# Altium project ESP32_INDUSTRIAL_IO.PrjPcb (part 2 of 2)

## Sheet EtherCAT.SchDoc
size B
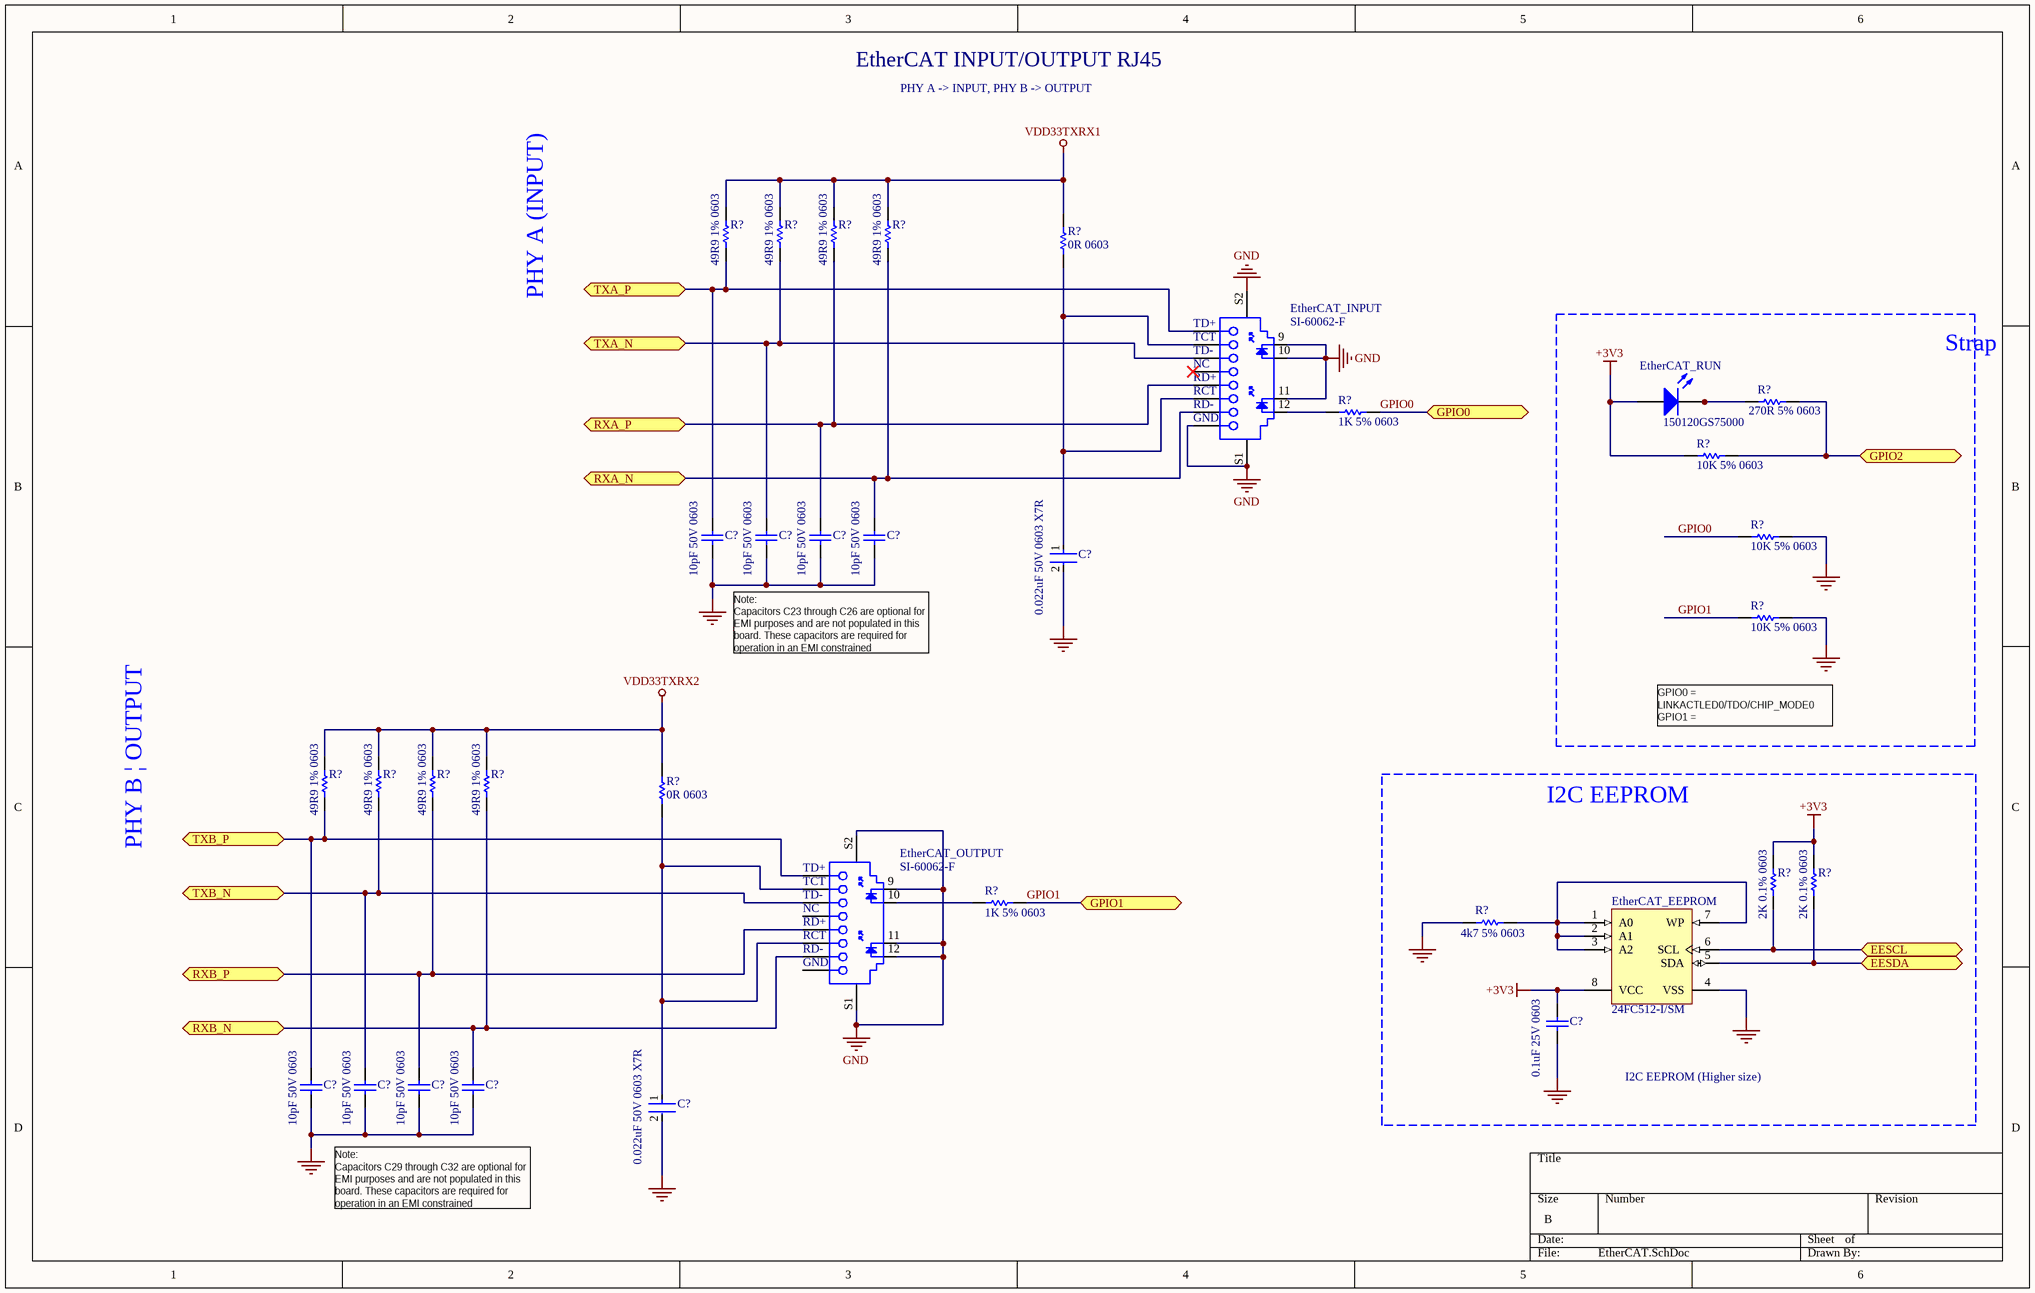
[diagram p5: EtherCAT.SchDoc]

### Parts
(Parts that share a designator on the sheet are numbered #1, #2 ... from top to bottom, then left to right.)
C?#23  10pF 50V 0603  [CAPC1608X90X35LL10T15]
C?#24  10pF 50V 0603  [CAPC1608X90X35LL10T15]
C?#25  10pF 50V 0603  [CAPC1608X90X35LL10T15]
C?#26  10pF 50V 0603  [CAPC1608X90X35LL10T15]
C?#27  0.022uF 50V 0603 X7R  [FP-C0603C-CF-MFG]
C?#28  0.1uF 25V 0603  [CAPC1608X90X35LL10T15]
C?#29  10pF 50V 0603  [CAPC1608X90X35LL10T15]
C?#30  10pF 50V 0603  [CAPC1608X90X35LL10T15]
C?#31  10pF 50V 0603  [CAPC1608X90X35LL10T15]
C?#32  10pF 50V 0603  [CAPC1608X90X35LL10T15]
C?#33  0.022uF 50V 0603 X7R  [FP-C0603C-CF-MFG]
EtherCAT_EEPROM  24FC512-I/SM  [SOIJ-SM8_M]
EtherCAT_INPUT  SI-60062-F  [BELF-SI-60062-F_V]
EtherCAT_OUTPUT  SI-60062-F  [BELF-SI-60062-F_V]
EtherCAT_RUN  150120GS75000  [1206_A]
R?#5  49R9 1% 0603  [RESC1608X55X25NL10T15]
R?#6  49R9 1% 0603  [RESC1608X55X25NL10T15]
R?#7  49R9 1% 0603  [RESC1608X55X25NL10T15]
R?#8  49R9 1% 0603  [RESC1608X55X25NL10T15]
R?#9  0R 0603  [RESC1608X55X25ML10T15]
R?#10  270R 5% 0603  [RESC1608X55X25LL10T15]
R?#11  1K 5% 0603  [RESC1608X55X25NL10T15]
R?#12  10K 5% 0603  [RESC1608X55X25ML10T15]
R?#13  10K 5% 0603  [RESC1608X55X25ML10T15]
R?#14  10K 5% 0603  [RESC1608X55X25ML10T15]
R?#15  49R9 1% 0603  [RESC1608X55X25NL10T15]
R?#16  49R9 1% 0603  [RESC1608X55X25NL10T15]
R?#17  49R9 1% 0603  [RESC1608X55X25NL10T15]
R?#18  49R9 1% 0603  [RESC1608X55X25NL10T15]
R?#19  0R 0603  [RESC1608X55X25ML10T15]
R?#20  2K 0.1% 0603  [RESC1608X55X25ML10T15]
R?#21  2K 0.1% 0603  [RESC1608X55X25ML10T15]
R?#22  1K 5% 0603  [RESC1608X55X25NL10T15]
R?#23  4k7 5% 0603  [RESC1608X55X25ML10T15]

### Blocks framed on the sheet
Strap: EtherCAT_RUN R?#10 R?#12-R?#14
I2C EEPROM: C?#28 EtherCAT_EEPROM R?#20 R?#21 R?#23

### Ports
EESCL (bidir), EESDA (bidir), GPIO0 (bidir), GPIO1 (bidir), GPIO2 (bidir), RXA_N (bidir), RXA_P (bidir), RXB_N (bidir), RXB_P (bidir), TXA_N (bidir), TXA_P (bidir), TXB_N (bidir), TXB_P (bidir)

### Nets
+3V3: C?#28.2 EtherCAT_EEPROM.8(VCC) EtherCAT_RUN.2(A) R?#12.2 R?#20.2 R?#21.2
GND: C?#23.1 C?#24.1 C?#25.1 C?#26.1 C?#27.2 C?#28.1 C?#29.1 C?#30.1 C?#31.1 C?#32.1 C?#33.2 EtherCAT_EEPROM.4(VSS) EtherCAT_INPUT.8(GND) EtherCAT_INPUT.9 EtherCAT_INPUT.10 EtherCAT_INPUT.11 EtherCAT_INPUT.S1 EtherCAT_INPUT.S2 EtherCAT_OUTPUT.9 EtherCAT_OUTPUT.11 EtherCAT_OUTPUT.12 EtherCAT_OUTPUT.S1 EtherCAT_OUTPUT.S2 R?#13.1 R?#14.1 R?#23.1
VDD33TXRX1: R?#5.2 R?#6.2 R?#7.2 R?#8.2 R?#9.2
VDD33TXRX2: R?#15.2 R?#16.2 R?#17.2 R?#18.2 R?#19.2
GPIO0: R?#11.2 R?#13.2 ; port GPIO0
GPIO1: R?#14.2 R?#22.2 ; port GPIO1
NetC?#23_2: C?#23.2 EtherCAT_INPUT.1(TD+) R?#5.1 ; port TXA_P
NetC?#24_2: C?#24.2 EtherCAT_INPUT.3(TD-) R?#6.1 ; port TXA_N
NetC?#25_2: C?#25.2 EtherCAT_INPUT.5(RD+) R?#7.1 ; port RXA_P
NetC?#26_2: C?#26.2 EtherCAT_INPUT.7(RD-) R?#8.1 ; port RXA_N
NetC?#27_1: C?#27.1 EtherCAT_INPUT.2(TCT) EtherCAT_INPUT.6(RCT) R?#9.1
NetC?#29_2: C?#29.2 EtherCAT_OUTPUT.1(TD+) R?#15.1 ; port TXB_P
NetC?#30_2: C?#30.2 EtherCAT_OUTPUT.3(TD-) R?#16.1 ; port TXB_N
NetC?#31_2: C?#31.2 EtherCAT_OUTPUT.5(RD+) R?#17.1 ; port RXB_P
NetC?#32_2: C?#32.2 EtherCAT_OUTPUT.7(RD-) R?#18.1 ; port RXB_N
NetC?#33_1: C?#33.1 EtherCAT_OUTPUT.2(TCT) EtherCAT_OUTPUT.6(RCT) R?#19.1
NetEtherCAT_EEPROM_1: EtherCAT_EEPROM.1(A0) EtherCAT_EEPROM.2(A1) EtherCAT_EEPROM.3(A2) EtherCAT_EEPROM.7(WP) R?#23.2
NetEtherCAT_EEPROM_5: EtherCAT_EEPROM.5(SDA) R?#21.1 ; port EESDA
NetEtherCAT_EEPROM_6: EtherCAT_EEPROM.6(SCL) R?#20.1 ; port EESCL
NetEtherCAT_INPUT_12: EtherCAT_INPUT.12 R?#11.1
NetEtherCAT_OUTPUT_10: EtherCAT_OUTPUT.10 R?#22.1
NetEtherCAT_RUN_1: EtherCAT_RUN.1(K) R?#10.1
NetLAN9252_45: R?#10.2 R?#12.1 ; port GPIO2

Not connected (* = marked no-connect by the designer): EtherCAT_INPUT 4(NC)*; EtherCAT_OUTPUT 4(NC) 8(GND)

### Notes on the sheet
- EtherCAT INPUT/OUTPUT RJ45
- PHY A -> INPUT, PHY B -> OUTPUT
- PHY A (INPUT)
- (near C?#24) Note:
  Capacitors C23 through C26 are optional for EMI purposes and are not populated in this  board. These capacitors are required for operation in an EMI constrained environment.
- GPIO0 = LINKACTLED0/TDO/CHIP_MODE0
  GPIO1 = LINKACTLED1/TDI/CHIP_MODE1
  GPIO2 = RUNLED/E2PSIZE
- PHY B | OUTPUT
- I2C EEPROM (Higher size)
- (near C?#30) Note:
  Capacitors C29 through C32 are optional for EMI purposes and are not populated in this  board. These capacitors are required for operation in an EMI constrained environment.

### Library data of the parts
C?#23-C?#26 C?#29-C?#32 = CMP-2006-02592-1: Part Number: GRM1885C1H100JA01D; Manufacturer: Murata
C?#27 C?#33 = CMP-2006-03879-3: Ceramic Capacitor 0.022Uf 50V, X7R, 10%, 0603, Full Reel; Manufacturer Part Number: C0603C223K5RACTU; Manufacturer: KEMET; Automotive Grade: Grade 1; Capacitance: 22,000 pF; Value: 22,000 pF; Tolerance: 0.1; Temperature Coefficient: 30ppm/°C; Material: Ceramic; Mouser Description: Capacitor; Ceramic; Cap; .022uF; Tol+10%; SMT; Vol-Rtg 50V; X7R; TR; Voltage Rating: 50 V; Category: Cap; Device Class L2: Capacitors; RoHS: TRUE; Package: C0603C-CF; Device Class L1: Passive Components; Temperature Range Low: -55°C; Octopart: https://octopart.com/c0603c223k5ractu-kemet-97352; Temperature: -55°C to +125°C; Temperature Range High: +125°C; Automotive: Yes; Lead Free: Yes; ComponentLink2URL: https://api.kemet.com/component-edge/download/datasheet/C0603C100J5GACAUTO.pdf; Temperature Characteristic: X7R; Height: 0.87mm; Device Class L3: Ceramic Capacitors; Digikey Description: Ceramic Capacitor 0.022Uf 50V, X7R, 10%, 0603, Full Reel; ComponentLink2Description: Datasheet
C?#28 = CMP-2006-02868-1: Part Number: GRM188R71E104KA01D; Manufacturer: Murata
EtherCAT_EEPROM = CMP-0159-00532-1: 512Kbit, 1MHz, 2.5V, I2C Serial EEPROM, 8-Pin SOIC 208mil, Industrial Temperature; PackageDescription: 8-Lead Plastic Small Outline (SM) - Medium, 5.28 mm Body [SOIJ]; PackageReference: SOIJ-SM8; PackageVersion: revBB, Aug-2009; DatasheetVersion: revJ, Jul-2008
EtherCAT_INPUT EtherCAT_OUTPUT = CMP-2000-07059-1: 1 Port RJ45 Magjack Connector with Yellow and Green LED, 10/100 Base-T, 12-Pin THD, RoHS, Tray; Manufacturer: Bel Fuse; Number of Ways: 8P4C; Gender: Female; Shield Type: STP; Connector Type: RJ45; Contact Plating: Gold; Mounting Type: ThroughHole; Datasheet Version: Rev. B0, 09/2008; Package Reference: SI-60062-F; Manufacturer URL: http://belfuse.com/; Package Description: 12-Pin Through Hole Device, Body 21.59 x 16.13 mm; Series: MagJack; Contact Material: CopperAlloy; Datasheet URL: http://belfuse.com/pdfs/SI-60062-F.pdf; Width: 17.98mm; Length: 15.21mm; Mounting Technology: ThroughHole; Depth: 21.59mm; Orientation: Straight
EtherCAT_RUN = CMP-1426-00014-1: SMD mono-color Chip LED, WL-SMCW, Green; Manufacturer: Wuerth Elektronik; PackageReference: 1206_A; PartNumber: 150120GS75000; ComponentLink1Description: Manufacturer URL; ComponentLink2URL: http://katalog.we-online.com/led/datasheet/150120GS75000.pdf; ComponentLink2Description: Datasheet; Color: Green; ComponentLink1URL: http://www.we-online.com
R?#5-R?#8 R?#15-R?#18 = CMP-1659-00036-1: General Purpose Chip Resistor, 49.9 Ohm, +/- 1%, -55 to 155 degC, 0603 (1608 Metric), RoHS, Tape and Reel; Max Supply Voltage: 3.63 V; Case\Package: LQFP; Interface: SPI; Min Supply Voltage: 2.97 V; PackageReference: 0603; Packaging: Tray; ComponentLink2Description: Datasheet; ComponentLink1Description: Manufacturer URL; ComponentLink2URL: https://datasheet.ciiva.com/11808/0900766b80f96399-11808223.pdf; RoHSCompliant: true; Max Operating Temperature: 85 degC; ComponentLink1URL: http://www.yageo.com/; PackageDescription: 2-Pin Surface Mount Device, Body 1.6 x 0.8 mm; DatasheetVersion: Rev. 4, 04/2009; Min Operating Temperature: -40 degC; Package Quantity: 250; Pins: 48
R?#9 R?#19 = CMP-2100-03667-1: Chip Resistor, 0 Ohm, +/- 5%, 0.1 W, -55 to 155 degC, 0603 (1608 Metric), RoHS, Tape and Reel; Manufacturer: Yageo; Temperature Coefficient: 200ppm/degreesC; Voltage Rating: 50V; Power Rating: 100mW; Resistance: 0mOhm; Width: 0.8mm; Max Operating Temperature: 155degC; Tolerance: 5%; Package Reference: 0603; Height: 0.45mm; Depth: 0.8mm; Package Description: 2-Pin Surface Mount Device, Body 1.6 x 0.8 mm; Termination: SMD/SMT; Package Quantity: 5000; Case/Package: 0603; Case Code (Imperial): 0603; Radiation Hardening: No; Number of Pins: 2; Length: 1.6mm; Lead Free: LeadFree; Voltage Rating (DC): 50V; Military Standard: Not; Datasheet URL: http://www.yageo.com/NewPortal/yageodocoutput?fileName=/pdf/R-Chip/PYu-RC_Group_51_RoHS_L_5.pdf; Manufacturer URL: http://www.yageo.com/; Packaging: TapeandReel; Case Code (Metric): 1608; Min Operating Temperature: -55degC; Composition: ThickFilm; RoHSCompliant: true; Contact Plating: Tin; Datasheet Version: Rev. 5, 10/2016; REACH SVHC: NoSVHC
R?#10 = CMP-2000-06956-1: Chip Resistor, 270 Ohm, +/- 5%, 0.1 W, -55 to 155 degC, 0603 (1608 Metric), RoHS, Tape and Reel; Manufacturer: Yageo; Resistor Case Style: 0603[1608Metric]; Resistance: 270ohm; Resistor Element Type: ThickFilm; Voltage Rating: 50V; Temperature Coefficient: ±100ppm/°C; SVHC: ToBeAdvised; Product Range: RCSeries; Power Rating: 100mW; MSL: MSL1-Unlimited; Datasheet URL: http://www.yageo.com/documents/recent/PYu-RC_Group_51_RoHS_L_7.pdf; Packaging: CutTape; Manufacturer URL: http://www.yageo.com/; Automotive Qualification Standard: -; Resistance Tolerance: ±5%; Package Reference: 0603; Package Description: 2-Pin Surface Mount Device, Body 1.6 x 0.8 mm; Mounting Technology: SurfaceMount; Datasheet Version: Rev. 7, 05/2017
R?#11 R?#22 = CMP-1659-00009-4: Chip Resistor, 1 KOhm, +/-1%, 0.1 W, -55 to 155 degC, 0603 (1608 Metric), RoHS, Tape and Reel; Manufacturer: Yageo; Voltage Rating: 50 V; ComponentLink2URL: http://www.yageo.com/documents/recent/PYu-RC_Group_51_RoHS_L_04.pdf; Max Operating Temperature: 155 degC; PackageDescription: 2-Pin Surface Mount Device, Body 1.6 x 0.8 mm; Packaging: Tape and Reel; ComponentLink3Description: Package Specification; REACH SVHC: No SVHC; Mount: Surface Mount; ComponentLink2Description: Datasheet; Length: 1.6 mm; PackageReference: 0603; Height: 0.45 mm; DatasheetVersion: Rev. 4, 02/2016; Min Operating Temperature: -55 degC; ComponentLink1Description: Manufacturer URL; Package Quantity: 200; RoHSCompliant: true; ComponentLink3URL: http://www.farnell.com/datasheets/443971.pdf; Pins: 2; Mounting Technology: Surface Mount; ComponentLink1URL: http://www.yageo.com/
R?#12-R?#14 = CMP-2100-03664-1: Chip Resistor, 10 KOhm, +/- 1%, 01 W, -55 to 155 degC, 0603 (1608 Metric), RoHS, Tape and Reel; Manufacturer: Yageo; Temperature Coefficient: 100ppm/degreesC; Resistance: 10KOhm; Voltage Rating: 75V; Power Rating: 100mW; Voltage Rating (DC): 50V; Composition: ThickFilm; RoHSCompliant: true; Height: 0.45mm; Lead Free: LeadFree; Case Code (Metric): 1608; Case/Package: 0603; Datasheet Version: Rev. 5, 10/2016; Package Reference: 0603; Depth: 0.8mm; Package Description: 2-Pin Surface Mount Device, Body 1.6 x 0.8 mm; Case Code (Imperial): 0603; Packaging: TapeandReel; Termination: SMD/SMT; Lead Pitch: 0.3mm; Width: 0.8mm; Number of Pins: 2; Length: 1.6mm; REACH SVHC: NoSVHC; Military Standard: Not; Max Operating Temperature: 155degC; Min Operating Temperature: -55degC; Manufacturer URL: http://www.yageo.com/; Datasheet URL: http://www.yageo.com/NewPortal/yageodocoutput?fileName=/pdf/R-Chip/PYu-RC_Group_51_RoHS_L_5.pdf; Weight: 7.1E-05oz; Tolerance: 1%
R?#20 R?#21 = CMP-2000-04430-1: Part Number: RT0603BRD072KL; Manufacturer: Yageo
R?#23 = CMP-2000-05024-1: Chip Resistor, 4.7 KOhm, +/- 5%, 100 mW, -55 to 155 degC, 0603 (1608 Metric), RoHS, Tape and Reel; Manufacturer: Yageo; Resistance: 4.7kOhms; Temperature Coefficient: 100PPM/C; Power Rating: 100mW; Voltage Rating: 50V; Operating Temperature Range: -55Cto+155C; Case Code - mm: 1608; Tolerance: 5%; Product: ThickFilmResistorsGeneralPurpose; Case Code - in: 0603; Datasheet URL: http://www.yageo.com/documents/recent/PYu-RC_Group_51_RoHS_L_04.pdf; Package Reference: 603; Datasheet Version: Rev. 4, 02/2016; Package Description: 2-Pin Surface Mount Device, Body 1.6 x 0.8 mm; Manufacturer URL: http://www.yageo.com/; Series: RC; Packaging: Reel; Termination Style: SMD/SMT

## Sheet MCP23017-1.SchDoc
size B
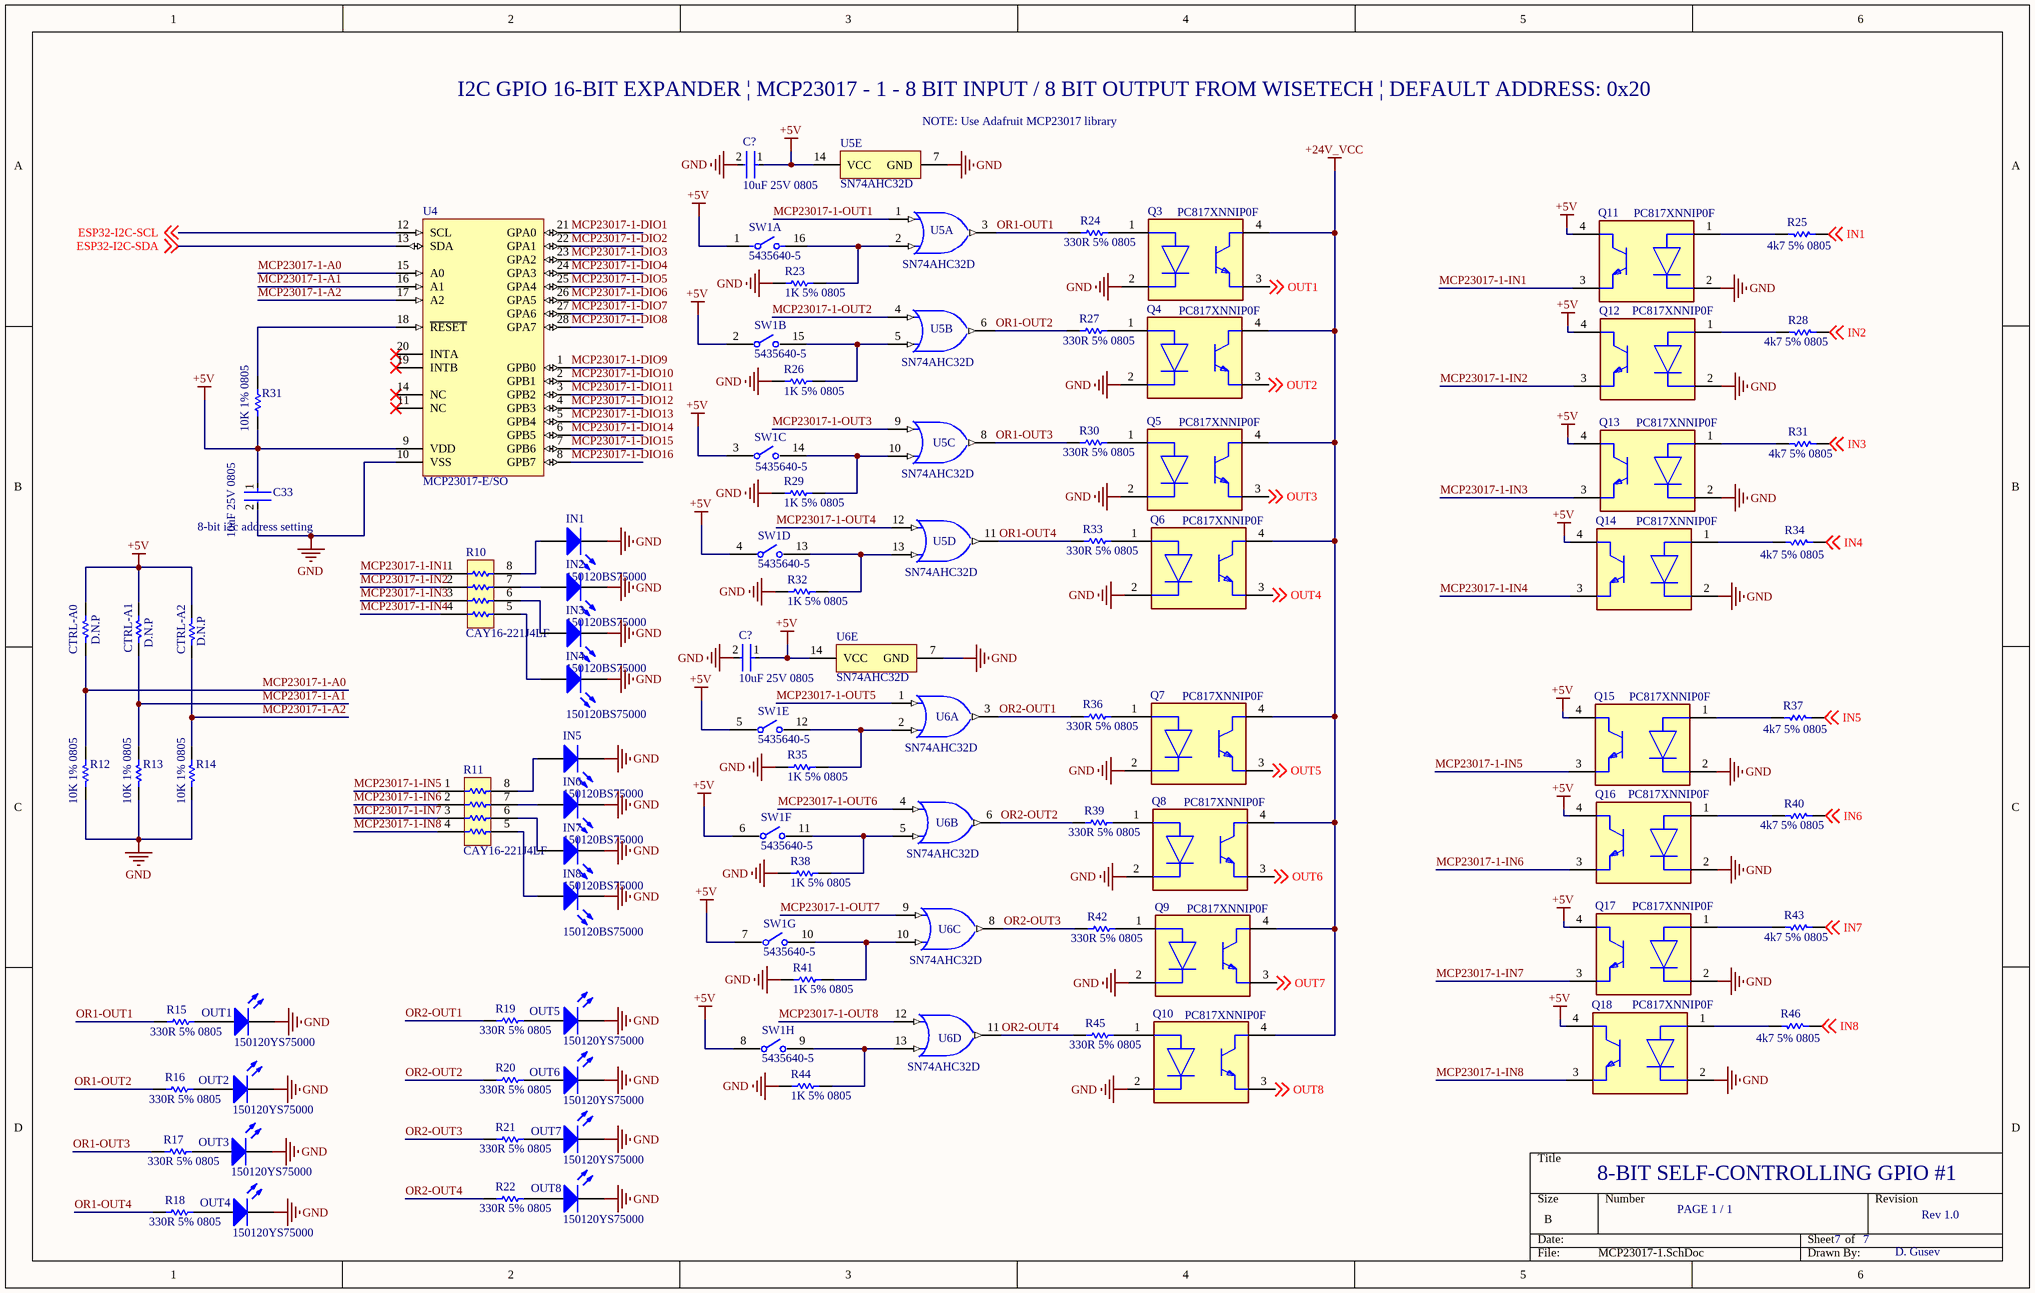
[diagram p6: MCP23017-1.SchDoc]

### Parts
(Parts that share a designator on the sheet are numbered #1, #2 ... from top to bottom, then left to right.)
C33  10uF 25V 0805  [FP-GRM21B-0_15-IPC_B]
C?#34  10uF 25V 0805  [FP-GRM21B-0_15-IPC_B]
C?#35  10uF 25V 0805  [FP-GRM21B-0_15-IPC_B]
CTRL-A0  D.N.P  [RESC2013X60X35LL10T20]
CTRL-A1  D.N.P  [RESC2013X60X35LL10T20]
CTRL-A2  D.N.P  [RESC2013X60X35LL10T20]
IN1  150120BS75000  [1206_A]
IN2  150120BS75000  [1206_A]
IN3  150120BS75000  [1206_A]
IN4  150120BS75000  [1206_A]
IN5  150120BS75000  [1206_A]
IN6  150120BS75000  [1206_A]
IN7  150120BS75000  [1206_A]
IN8  150120BS75000  [1206_A]
OUT1  150120YS75000  [1206_A]
OUT2  150120YS75000  [1206_A]
OUT3  150120YS75000  [1206_A]
OUT4  150120YS75000  [1206_A]
OUT5  150120YS75000  [1206_A]
OUT6  150120YS75000  [1206_A]
OUT7  150120YS75000  [1206_A]
OUT8  150120YS75000  [1206_A]
Q3  PC817XNNIP0F  [FP-PC817XNNIP0F-MFG]
Q4  PC817XNNIP0F  [FP-PC817XNNIP0F-MFG]
Q5  PC817XNNIP0F  [FP-PC817XNNIP0F-MFG]
Q6  PC817XNNIP0F  [FP-PC817XNNIP0F-MFG]
Q7  PC817XNNIP0F  [FP-PC817XNNIP0F-MFG]
Q8  PC817XNNIP0F  [FP-PC817XNNIP0F-MFG]
Q9  PC817XNNIP0F  [FP-PC817XNNIP0F-MFG]
Q10  PC817XNNIP0F  [FP-PC817XNNIP0F-MFG]
Q11  PC817XNNIP0F  [FP-PC817XNNIP0F-MFG]
Q12  PC817XNNIP0F  [FP-PC817XNNIP0F-MFG]
Q13  PC817XNNIP0F  [FP-PC817XNNIP0F-MFG]
Q14  PC817XNNIP0F  [FP-PC817XNNIP0F-MFG]
Q15  PC817XNNIP0F  [FP-PC817XNNIP0F-MFG]
Q16  PC817XNNIP0F  [FP-PC817XNNIP0F-MFG]
Q17  PC817XNNIP0F  [FP-PC817XNNIP0F-MFG]
Q18  PC817XNNIP0F  [FP-PC817XNNIP0F-MFG]
R10  CAY16-221J4LF  [BOUR-CAY16-J4_V]
R11  CAY16-221J4LF  [BOUR-CAY16-J4_V]
R12  10K 1% 0805  [RESC2013X60X35ML10T20]
R13  10K 1% 0805  [RESC2013X60X35ML10T20]
R14  10K 1% 0805  [RESC2013X60X35ML10T20]
R15  330R 5% 0805  [RESC2013X60X35LL10T20]
R16  330R 5% 0805  [RESC2013X60X35LL10T20]
R17  330R 5% 0805  [RESC2013X60X35LL10T20]
R18  330R 5% 0805  [RESC2013X60X35LL10T20]
R19  330R 5% 0805  [RESC2013X60X35LL10T20]
R20  330R 5% 0805  [RESC2013X60X35LL10T20]
R21  330R 5% 0805  [RESC2013X60X35LL10T20]
R22  330R 5% 0805  [RESC2013X60X35LL10T20]
R23  1K 5% 0805  [RESC2013X60X35ML10T20]
R24  330R 5% 0805  [RESC2013X60X35LL10T20]
R25  4k7 5% 0805  [YAGO-RC0805_M]
R26  1K 5% 0805  [RESC2013X60X35ML10T20]
R27  330R 5% 0805  [RESC2013X60X35LL10T20]
R28  4k7 5% 0805  [YAGO-RC0805_M]
R29  1K 5% 0805  [RESC2013X60X35ML10T20]
R30  330R 5% 0805  [RESC2013X60X35LL10T20]
R31#1  10K 1% 0805  [RESC2013X60X35ML10T20]
R31#2  4k7 5% 0805  [YAGO-RC0805_M]
R32  1K 5% 0805  [RESC2013X60X35ML10T20]
R33  330R 5% 0805  [RESC2013X60X35LL10T20]
R34  4k7 5% 0805  [YAGO-RC0805_M]
R35  1K 5% 0805  [RESC2013X60X35ML10T20]
R36  330R 5% 0805  [RESC2013X60X35LL10T20]
R37  4k7 5% 0805  [YAGO-RC0805_M]
R38  1K 5% 0805  [RESC2013X60X35ML10T20]
R39  330R 5% 0805  [RESC2013X60X35LL10T20]
R40  4k7 5% 0805  [YAGO-RC0805_M]
R41  1K 5% 0805  [RESC2013X60X35ML10T20]
R42  330R 5% 0805  [RESC2013X60X35LL10T20]
R43  4k7 5% 0805  [YAGO-RC0805_M]
R44  1K 5% 0805  [RESC2013X60X35ML10T20]
R45  330R 5% 0805  [RESC2013X60X35LL10T20]
R46  4k7 5% 0805  [YAGO-RC0805_M]
SW1  5435640-5  [FP-5435640-5-MFG]  (parts A,B,C,D,E,F,G,H of 8)
U4  MCP23017-E/SO  [SOIC-SO28_N]
U5  SN74AHC32D  [D0014A_M]  (parts A,B,C,D,E of 5)
U6  SN74AHC32D  [D0014A_M]  (parts A,B,C,D,E of 5)

### Nets
+5V: C33.1 C?#34.1 C?#35.1 CTRL-A0.2 CTRL-A1.2 CTRL-A2.2 Q11.4(C) Q12.4(C) Q13.4(C) Q14.4(C) Q15.4(C) Q16.4(C) Q17.4(C) Q18.4(C) R31#1.1 SW1.1 SW1.2 SW1.3 SW1.4 SW1.5 SW1.6 SW1.7 SW1.8 U4.9(VDD) U5.14(VCC) U6.14(VCC)
+24V_VCC: Q3.4(C) Q4.4(C) Q5.4(C) Q6.4(C) Q7.4(C) Q8.4(C) Q9.4(C) Q10.4(C)
GND: C33.2 C?#34.2 C?#35.2 IN1.1(K) IN2.1(K) IN3.1(K) IN4.1(K) IN5.1(K) IN6.1(K) IN7.1(K) IN8.1(K) OUT1.1(K) OUT2.1(K) OUT3.1(K) OUT4.1(K) OUT5.1(K) OUT6.1(K) OUT7.1(K) OUT8.1(K) Q3.2(C) Q4.2(C) Q5.2(C) Q6.2(C) Q7.2(C) Q8.2(C) Q9.2(C) Q10.2(C) Q11.2(C) Q12.2(C) Q13.2(C) Q14.2(C) Q15.2(C) Q16.2(C) Q17.2(C) Q18.2(C) R12.2 R13.2 R14.2 R23.1 R26.1 R29.1 R32.1 R35.1 R38.1 R41.1 R44.1 U4.10(VSS) U5.7(GND) U6.7(GND)
ESP32-I2C-SCL: U4.12(SCL) ; off-sheet ESP32-I2C-SCL
ESP32-I2C-SDA: U4.13(SDA) ; off-sheet ESP32-I2C-SDA
IN1: R25.1 ; off-sheet IN1
IN2: R28.1 ; off-sheet IN2
IN3: R31#2.1 ; off-sheet IN3
IN4: R34.1 ; off-sheet IN4
IN5: R37.1 ; off-sheet IN5
IN6: R40.1 ; off-sheet IN6
IN7: R43.1 ; off-sheet IN7
IN8: R46.1 ; off-sheet IN8
MCP23017-1-A0: CTRL-A0.1 R12.1 U4.15(A0)
MCP23017-1-A1: CTRL-A1.1 R13.1 U4.16(A1)
MCP23017-1-A2: CTRL-A2.1 R14.1 U4.17(A2)
MCP23017-1-DIO1: U4.21(GPA0)
MCP23017-1-DIO2: U4.22(GPA1)
MCP23017-1-DIO3: U4.23(GPA2)
MCP23017-1-DIO4: U4.24(GPA3)
MCP23017-1-DIO5: U4.25(GPA4)
MCP23017-1-DIO6: U4.26(GPA5)
MCP23017-1-DIO7: U4.27(GPA6)
MCP23017-1-DIO8: U4.28(GPA7)
MCP23017-1-DIO9: U4.1(GPB0)
MCP23017-1-DIO10: U4.2(GPB1)
MCP23017-1-DIO11: U4.3(GPB2)
MCP23017-1-DIO12: U4.4(GPB3)
MCP23017-1-DIO13: U4.5(GPB4)
MCP23017-1-DIO14: U4.6(GPB5)
MCP23017-1-DIO15: U4.7(GPB6)
MCP23017-1-DIO16: U4.8(GPB7)
MCP23017-1-IN1: Q11.3(E) R10.1
MCP23017-1-IN2: Q12.3(E) R10.2
MCP23017-1-IN3: Q13.3(E) R10.3
MCP23017-1-IN4: Q14.3(E) R10.4
MCP23017-1-IN5: Q15.3(E) R11.1
MCP23017-1-IN6: Q16.3(E) R11.2
MCP23017-1-IN7: Q17.3(E) R11.3
MCP23017-1-IN8: Q18.3(E) R11.4
MCP23017-1-OUT1: U5.1(1A)
MCP23017-1-OUT2: U5.4(2A)
MCP23017-1-OUT3: U5.9(3A)
MCP23017-1-OUT4: U5.12(4A)
MCP23017-1-OUT5: U6.1(1A)
MCP23017-1-OUT6: U6.4(2A)
MCP23017-1-OUT7: U6.9(3A)
MCP23017-1-OUT8: U6.12(4A)
OR1-OUT1: R15.1 R24.1 U5.3(1Y)
OR1-OUT2: R16.1 R27.1 U5.6(2Y)
OR1-OUT3: R17.1 R30.1 U5.8(3Y)
OR1-OUT4: R18.1 R33.1 U5.11(4Y)
OR2-OUT1: R19.1 R36.1 U6.3(1Y)
OR2-OUT2: R20.1 R39.1 U6.6(2Y)
OR2-OUT3: R21.1 R42.1 U6.8(3Y)
OR2-OUT4: R22.1 R45.1 U6.11(4Y)
OUT1: Q3.3(E) ; off-sheet OUT1
OUT2: Q4.3(E) ; off-sheet OUT2
OUT3: Q5.3(E) ; off-sheet OUT3
OUT4: Q6.3(E) ; off-sheet OUT4
OUT5: Q7.3(E) ; off-sheet OUT5
OUT6: Q8.3(E) ; off-sheet OUT6
OUT7: Q9.3(E) ; off-sheet OUT7
OUT8: Q10.3(E) ; off-sheet OUT8
NetIN1_2: IN1.2(A) R10.8
NetIN2_2: IN2.2(A) R10.7
NetIN3_2: IN3.2(A) R10.6
NetIN4_2: IN4.2(A) R10.5
NetIN5_2: IN5.2(A) R11.8
NetIN6_2: IN6.2(A) R11.7
NetIN7_2: IN7.2(A) R11.6
NetIN8_2: IN8.2(A) R11.5
NetOUT1_2: OUT1.2(A) R15.2
NetOUT2_2: OUT2.2(A) R16.2
NetOUT3_2: OUT3.2(A) R17.2
NetOUT4_2: OUT4.2(A) R18.2
NetOUT5_2: OUT5.2(A) R19.2
NetOUT6_2: OUT6.2(A) R20.2
NetOUT7_2: OUT7.2(A) R21.2
NetOUT8_2: OUT8.2(A) R22.2
NetQ3_1: Q3.1(A) R24.2
NetQ4_1: Q4.1(A) R27.2
NetQ5_1: Q5.1(A) R30.2
NetQ6_1: Q6.1(A) R33.2
NetQ7_1: Q7.1(A) R36.2
NetQ8_1: Q8.1(A) R39.2
NetQ9_1: Q9.1(A) R42.2
NetQ10_1: Q10.1(A) R45.2
NetQ11_1: Q11.1(A) R25.2
NetQ12_1: Q12.1(A) R28.2
NetQ13_1: Q13.1(A) R31#2.2
NetQ14_1: Q14.1(A) R34.2
NetQ15_1: Q15.1(A) R37.2
NetQ16_1: Q16.1(A) R40.2
NetQ17_1: Q17.1(A) R43.2
NetQ18_1: Q18.1(A) R46.2
NetR23_2: R23.2 SW1.16 U5.2(1B)
NetR26_2: R26.2 SW1.15 U5.5(2B)
NetR29_2: R29.2 SW1.14 U5.10(3B)
NetR31#1_2: R31#1.2 U4.18(~{RESET})
NetR32_2: R32.2 SW1.13 U5.13(4B)
NetR35_2: R35.2 SW1.12 U6.2(1B)
NetR38_2: R38.2 SW1.11 U6.5(2B)
NetR41_2: R41.2 SW1.10 U6.10(3B)
NetR44_2: R44.2 SW1.9 U6.13(4B)

Not connected (* = marked no-connect by the designer): U4 11(NC)* 14(NC)* 19(INTB)* 20(INTA)*

### Notes on the sheet
- I2C GPIO 16-BIT EXPANDER | MCP23017 - 1 - 8 BIT INPUT / 8 BIT OUTPUT FROM WISETECH | DEFAULT ADDRESS: 0x20
- (near U5) NOTE: Use Adafruit MCP23017 library
- 8-bit i2c address setting
- 8-BIT SELF-CONTROLLING GPIO #1
- PAGE 1 / 1
- 7
- Rev 1.0
- D. Gusev

### Library data of the parts
C33 C?#34 C?#35 = CMP-2007-03541-2: Chip Multilayer Ceramic Capacitors for General Purpose, 0805, 10uF, X5R, 15%, 10%, 25V; Length: 2mm; Depth: 1.25mm; Termination: SMD/SMT; Voltage: 25V; Height: 1.25mm; Material: Ceramic; Thickness: 0.053inch; Radiation Hardening: No; Min Operating Temperature: -55°C; Width: 0.049inch; Package Quantity: 1; Mount: Surface Mount; Dielectric: X5R; Packaging: Tape and Reel; Capacitance: 10uF; Voltage Rating (DC): 25V; Lead Free: Lead Free; Max Operating Temperature: 85°C; Case Code (Imperial): 0805; Case/Package: 0805; Tolerance: 10%; Voltage Rating: 25V; Case Code (Metric): 2012
CTRL-A0-CTRL-A2 = CMP-1659-00014-4: Chip Resistor, 1 Ohm, +/- 1%, 125 mW, -55 to 155 degC, 0805 (2012 Metric), RoHS, Tape and Reel; Manufacturer: Yageo; Voltage Rating: 150 V; REACH SVHC: No SVHC; Mounting Technology: Surface Mount; RoHSCompliant: true; Packaging: Tape and Reel; ComponentLink2URL: http://www.yageo.com/documents/recent/PYu-RC_Group_51_RoHS_L_04.pdf; Pins: 2; Package Quantity: 5000; DatasheetVersion: Rev. 4, 02/2016; Mount: Surface Mount; Max Operating Temperature: 155 degC; PackageDescription: 2-Pin Surface Mounted Device, Body 2 x 1.25 mm; PackageReference: 0805; Length: 2 mm; Min Operating Temperature: -55 degC; ComponentLink1URL: http://www.yageo.com/; Height: 0.5 mm; ComponentLink1Description: Manufacturer URL; ComponentLink2Description: Datasheet
IN1-IN8 = CMP-1426-00015-1: SMD mono-color Chip LED, WL-SMCW, Blue; Manufacturer: Wuerth Elektronik; ComponentLink2Description: Datasheet; ComponentLink1URL: http://www.we-online.com; PartNumber: 150120BS75000; ComponentLink1Description: Manufacturer URL; ComponentLink2URL: http://katalog.we-online.com/led/datasheet/150120BS75000.pdf; PackageReference: 1206_A; Color: Blue
OUT1-OUT8 = CMP-1426-00019-1: SMD mono-color Chip LED, WL-SMCW, Yellow; Manufacturer: Wuerth Elektronik; ComponentLink2URL: http://katalog.we-online.com/led/datasheet/150120YS75000.pdf; PartNumber: 150120YS75000; ComponentLink1URL: http://www.we-online.com; Color: Yellow; ComponentLink1Description: Manufacturer URL; PackageReference: 1206_A; ComponentLink2Description: Datasheet
Q3-Q18 = CMP-65434-000005-1: OPTOISOLATOR 5KV TRANS 4SMD; Reverse Breakdown Voltage: 6V; Output Current per Channel: 30mA; Power Dissipation: 200mW; Collector-emitter Voltage-Max: 200mV; Max Output Voltage: 80V; Input Current: 50mA; Forward Voltage: 1.4V; Fall Time: 18000ns; Number of Elements: 1; Input Type: DC; Packaging: Tape and Reel; RoHS Compliant: Yes; Contact Plating: Copper; Min Operating Temperature: -30°C; Collector Emitter Saturation Voltage: 200mV; Max Input Current: 50mA; Radiation Hardening: No; Max Collector Current: 50mA; Case/Package: SMD/SMT; Mount: Surface Mount; Output Voltage: 80V; Forward Current: 50mA; Max Power Dissipation: 200mW; Collector Emitter Voltage (VCEO): 80V; Number of Channels: 1; Rise Time: 18000ns; Isolation Voltage: 5kV; Number of Pins: 4; Lead Free: Lead Free; Package Quantity: 2000; Isolation Voltage-Max: 5kV; Max Operating Temperature: 100°C
R10 R11 = CMP-1747-00006-1: Chip Resistor Array, 220 Ohm, +/- 5%, 62.5 mW, -55 to 125 degC, 8-Pin SMD, RoHS, Tape and Reel; Resistance: 562 kohm; Tolerance: 1%; Case\Package: 0603; Power Rating: 100 mW; Voltage Rating: 50 V; Max Operating Temperature: 155 degC; ComponentLink2Description: Datasheet; ComponentLink1Description: Manufacturer URL; Height: 0.45 mm; Min Operating Temperature: -55 degC; Length: 1.6 mm; DatasheetVersion: Sep-14; ComponentLink1URL: http://www.bourns.com/; ComponentLink2URL: http://www.bourns.com/pdfs/CATCAY.pdf; Case Code (Imperial): 0603; PackageReference: CAY16-J4; Packaging: Tape and Reel; Case Code (Metric): 1608; RoHSCompliant: true; PackageDescription: 8-Pin Surface Mount Device, Body 1.6 x 3.2 mm, Pitch 0.8 mm
R12-R14 R31#1 = CMP-2000-05025-1: Chip Resistor, 10 KOhm, +/- 5%, 0.125 W, -55 to 155 degC, 0805 (2012 Metric), RoHS, Tape and Reel; Manufacturer: Yageo; Resistor Element Type: ThickFilm; Voltage Rating: 150V; Product Range: RCSeries; SVHC: ToBeAdvised; Resistor Case Style: 0805[2012Metric]; Temperature Coefficient: ±100ppm/degC; Power Rating: 250mW; Resistance: 10kohm; Automotive Qualification Standard: -; Datasheet Version: REV. 2, 09/2004; Packaging: CutTape; Resistance Tolerance: ±5%; MSL: MSL1-Unlimited; Manufacturer URL: http://www.yageo.com/; Datasheet URL: http://www.yageo.ru/pdf/RC0805.pdf; Package Description: 2-Pin Surface Mounted Device, Body 2 x 1.25 mm; Package Reference: 805
R15-R22 R24 R27 R30 R33 R36 R39 R42 R45 = CMP-2000-06960-1: Chip Resistor, 330 Ohm, +/- 1%, 125 mW, -55 to 155 degC, 0805 (2012 Metric), RoHS, Tape and Reel; Manufacturer: Yageo; Voltage Rating: 150V; Temperature Coefficient: 100PPM/C; Power Rating: 125mW(1/8W); Resistance: 330Ohms; Datasheet Version: Rev. 7, 05/2017; Termination Style: SMD/SMT; Case Code - mm: 2012; Package Description: 2-Pin Surface Mounted Device, Body 2 x 1.25 mm; Operating Temperature Range: -55Cto+155C; Case Code - in: 0805; Packaging: Reel; Tolerance: 1%; Package Reference: 0805; Mounting Technology: SurfaceMount; Product: ThickFilmResistorsGeneralPurpose; Series: RC; Manufacturer URL: http://www.yageo.com/; Datasheet URL: http://www.yageo.com/documents/recent/PYu-RC_Group_51_RoHS_L_7.pdf
R23 R26 R29 R32 R35 R38 R41 R44 = CMP-2100-03671-1: Chip Resistor, 1 KOhm, +/- 1%, 125 mW, -55 to 155 degC, 0805 (2012 Metric), RoHS, Tape and Reel; Manufacturer: Yageo; Temperature Coefficient: 100ppm/degreesC; Voltage Rating (DC): 150V; Max Power Dissipation: 125mW; Resistance: 1KOhm; Number of Pins: 2; Number of Terminations: 2; Datasheet URL: http://www.yageo.com/NewPortal/yageodocoutput?fileName=/pdf/R-Chip/PYu-RC_Group_51_RoHS_L_5.pdf; Length: 0.079inch; Package Description: 2-Pin Surface Mounted Device, Body 2 x 1.25 mm; Depth: 1.25mm; Height: 0.024inch; Military Standard: Not; Case/Package: 0805; Package Reference: 0805; RoHSCompliant: true; Lead Free: LeadFree; Packaging: TapeandReel; Package Quantity: 1; Datasheet Version: Rev. 5, 10/2016; Tolerance: 1%; Min Operating Temperature: -55degC; Voltage Rating: 150V; Composition: ThickFilm; Case Code (Imperial): 0805; Power Rating: 125mW; Width: 0.049inch; Case Code (Metric): 2012; Manufacturer URL: http://www.yageo.com/; Max Operating Temperature: 155degC; REACH SVHC: Unknown; Termination: SMD/SMT
R25 R28 R31#2 R34 R37 R40 R43 R46 = CMP-1568-00001-1: General Puprose Chip Resistor, 4700 Ohm +/- 1%, 0.125 W, -55 to 155 degC, 2-Pin SMD, RoHS, Tape and Reel; PartNumber: RC0805FR-074K7L; Tolerance: +/- 1%; Power: 0.125 W; PackageDescription: 2-Pin Surface Mount Device, Body 2 x 1.25 mm; ComponentLink2URL: http://www.yageo.com/documents/recent/PYu-RC_Group_51_RoHS_L-3.pdf; Temperature Min: -55 degC; Packing: Tape and Reel; Mounting Technology: Surface Mount; ComponentLink1URL: http://www.yageo.com/NewPortal/_en/index.jsp; Resistance: 4700 Ohm; Temperature Max: 155 degC; ComponentLink2Description: Datasheet; DatasheetVersion: Rev. 3; RoHS: TRUE; ComponentLink1Description: Manufacturer URL
SW1 = CMP-05209-000001-1: SWITCH ROCKER DIP SPST 60MA 5V; Contact Post Length: 0.14inch; Number of Switches: 8; Contact Resistance: 50mR; Actuator Material: Polyester; Pitch: 0.1inch; Sealable: No (Without); Actuator Length: 1.27mm; Contact Current Rating: 1A; Max Voltage Rating (DC): 24V; Washable: No; Voltage Rating (DC): 40V; Contact Plating: Gold; ELV: Compliant; Depth: 9.65mm; Height: 0.34inch; Length: 0.88inch; Housing Material: Polyester; Contact Material: Copper Alloy; Orientation: Straight; Series: 7100; Throw Configuration: SPST; RoHS Compliant: Yes; Case/Package: DIP; Radiation Hardening: No; Max Operating Temperature: 105°C; Lead Free: Lead Free; Current Rating: 60mA; Housing Color: Blue; Min Operating Temperature: -55°C; Actuator Type: Rocker; Package Quantity: 14; Number of Circuits: 8; Mount: Through Hole; Type: Switch; Terminal Pitch: 2.54mm; Termination: PC Pins; Packaging: Rail/Tube; Number of Positions: 8
U4 = CMP-0186-00161-2: 16-Bit I/O Expander with Serial Interface, 28-Pin SOIC, Extended Temperature; PackageReference: SOIC-SO28; ComponentLink2URL: http://ww1.microchip.com/downloads/en/DeviceDoc/21952b.pdf; PackageVersion: revBB, Aug-2009; ComponentLink1URL: http://www.microchip.com/; Code_JEDEC: MS-013; ComponentLink2Description: Datasheet; DatasheetVersion: revB, Feb-2007; PackageDescription: 28-Lead Plastic Small Outline (SO) - Wide 7.50mm Body [SOIC]; ComponentLink3Description: Package Specification; ComponentLink1Description: Manufacturer URL; RevisionNote: URLs added.; ComponentLink3URL: http://www.microchip.com/stellent/groups/techpub_sg/documents/packagingspec/en012702.pdf
U5 U6 = CMP-1573-00034-3: Quadruple 2-Input Positive-OR Gates, D0014A, TUBE; Manufacturer: Texas Instruments; Input Type: CMOS; VCC(Max)(V): 5.5; tpd @ Nom Voltage(Max)(ns): 13,8.5; F @ Nom Voltage(Max)(Mhz): 70; VCC(Min)(V): 2; Bits(#): 4; ICC @ Nom Voltage(Max)(mA): 0.02; Rating: Catalog; Output Drive (IOL/IOH)(Max)(mA): 50/-50; Voltage(Nom)(V): 3.3,5; Operating Temperature Range(C): -40 to 125; DatasheetVersion: SCLS247I; Output Type: CMOS; PackageVersion: http://www.ti.com/lit/ml/mpds177g/mpds177g.pdf; Code_JEDEC: MS-012; Generic Part Number: SN74AHC32; PackageReference: D0014A

## Sheet MCP23017-2.SchDoc
size B
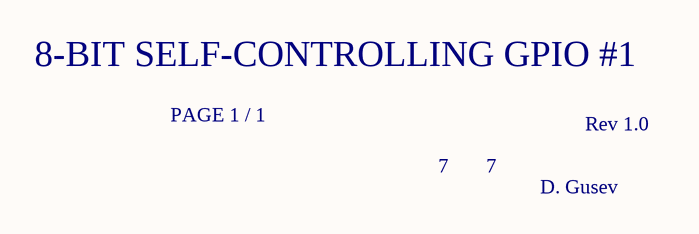
[diagram p7: MCP23017-2.SchDoc]

### Notes on the sheet
- 8-BIT SELF-CONTROLLING GPIO #1
- PAGE 1 / 1
- 7
- Rev 1.0
- D. Gusev

## Sheet MCP23017-3.SchDoc
size B
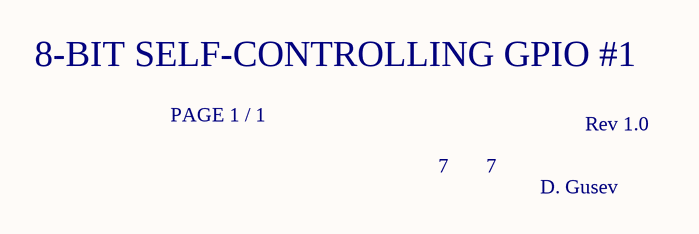
[diagram p8: MCP23017-3.SchDoc]

### Notes on the sheet
- 8-BIT SELF-CONTROLLING GPIO #1
- PAGE 1 / 1
- 7
- Rev 1.0
- D. Gusev

## Sheet MCP23017-4.SchDoc
size B
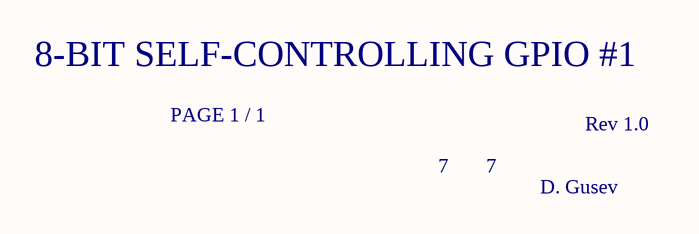
[diagram p9: MCP23017-4.SchDoc]

### Notes on the sheet
- 8-BIT SELF-CONTROLLING GPIO #1
- PAGE 1 / 1
- 7
- Rev 1.0
- D. Gusev

## Sheet MCP23017-5.SchDoc
size B
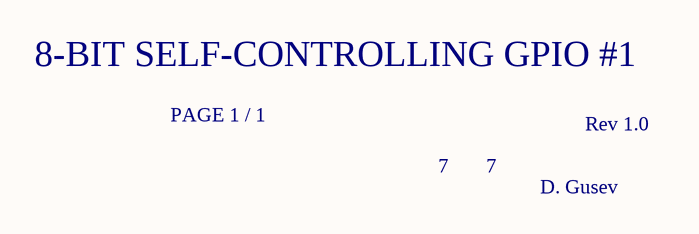
[diagram p10: MCP23017-5.SchDoc]

### Notes on the sheet
- 8-BIT SELF-CONTROLLING GPIO #1
- PAGE 1 / 1
- 7
- Rev 1.0
- D. Gusev

## Sheet MCP23017-6.SchDoc
size B
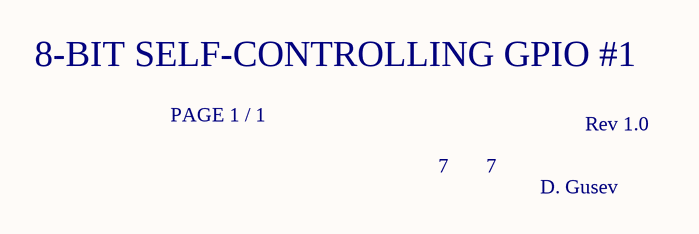
[diagram p11: MCP23017-6.SchDoc]

### Notes on the sheet
- 8-BIT SELF-CONTROLLING GPIO #1
- PAGE 1 / 1
- 7
- Rev 1.0
- D. Gusev

## Sheet MCP23017-7.SchDoc
size B
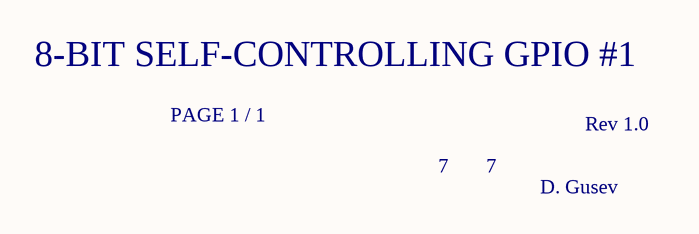
[diagram p12: MCP23017-7.SchDoc]

### Notes on the sheet
- 8-BIT SELF-CONTROLLING GPIO #1
- PAGE 1 / 1
- 7
- Rev 1.0
- D. Gusev

## Sheet MCP23017-8.SchDoc
size B
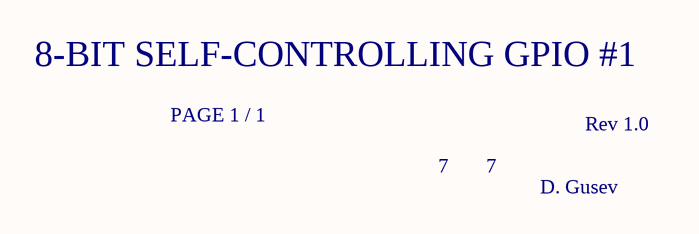
[diagram p13: MCP23017-8.SchDoc]

### Notes on the sheet
- 8-BIT SELF-CONTROLLING GPIO #1
- PAGE 1 / 1
- 7
- Rev 1.0
- D. Gusev

## Sheet CONN.SchDoc
size B
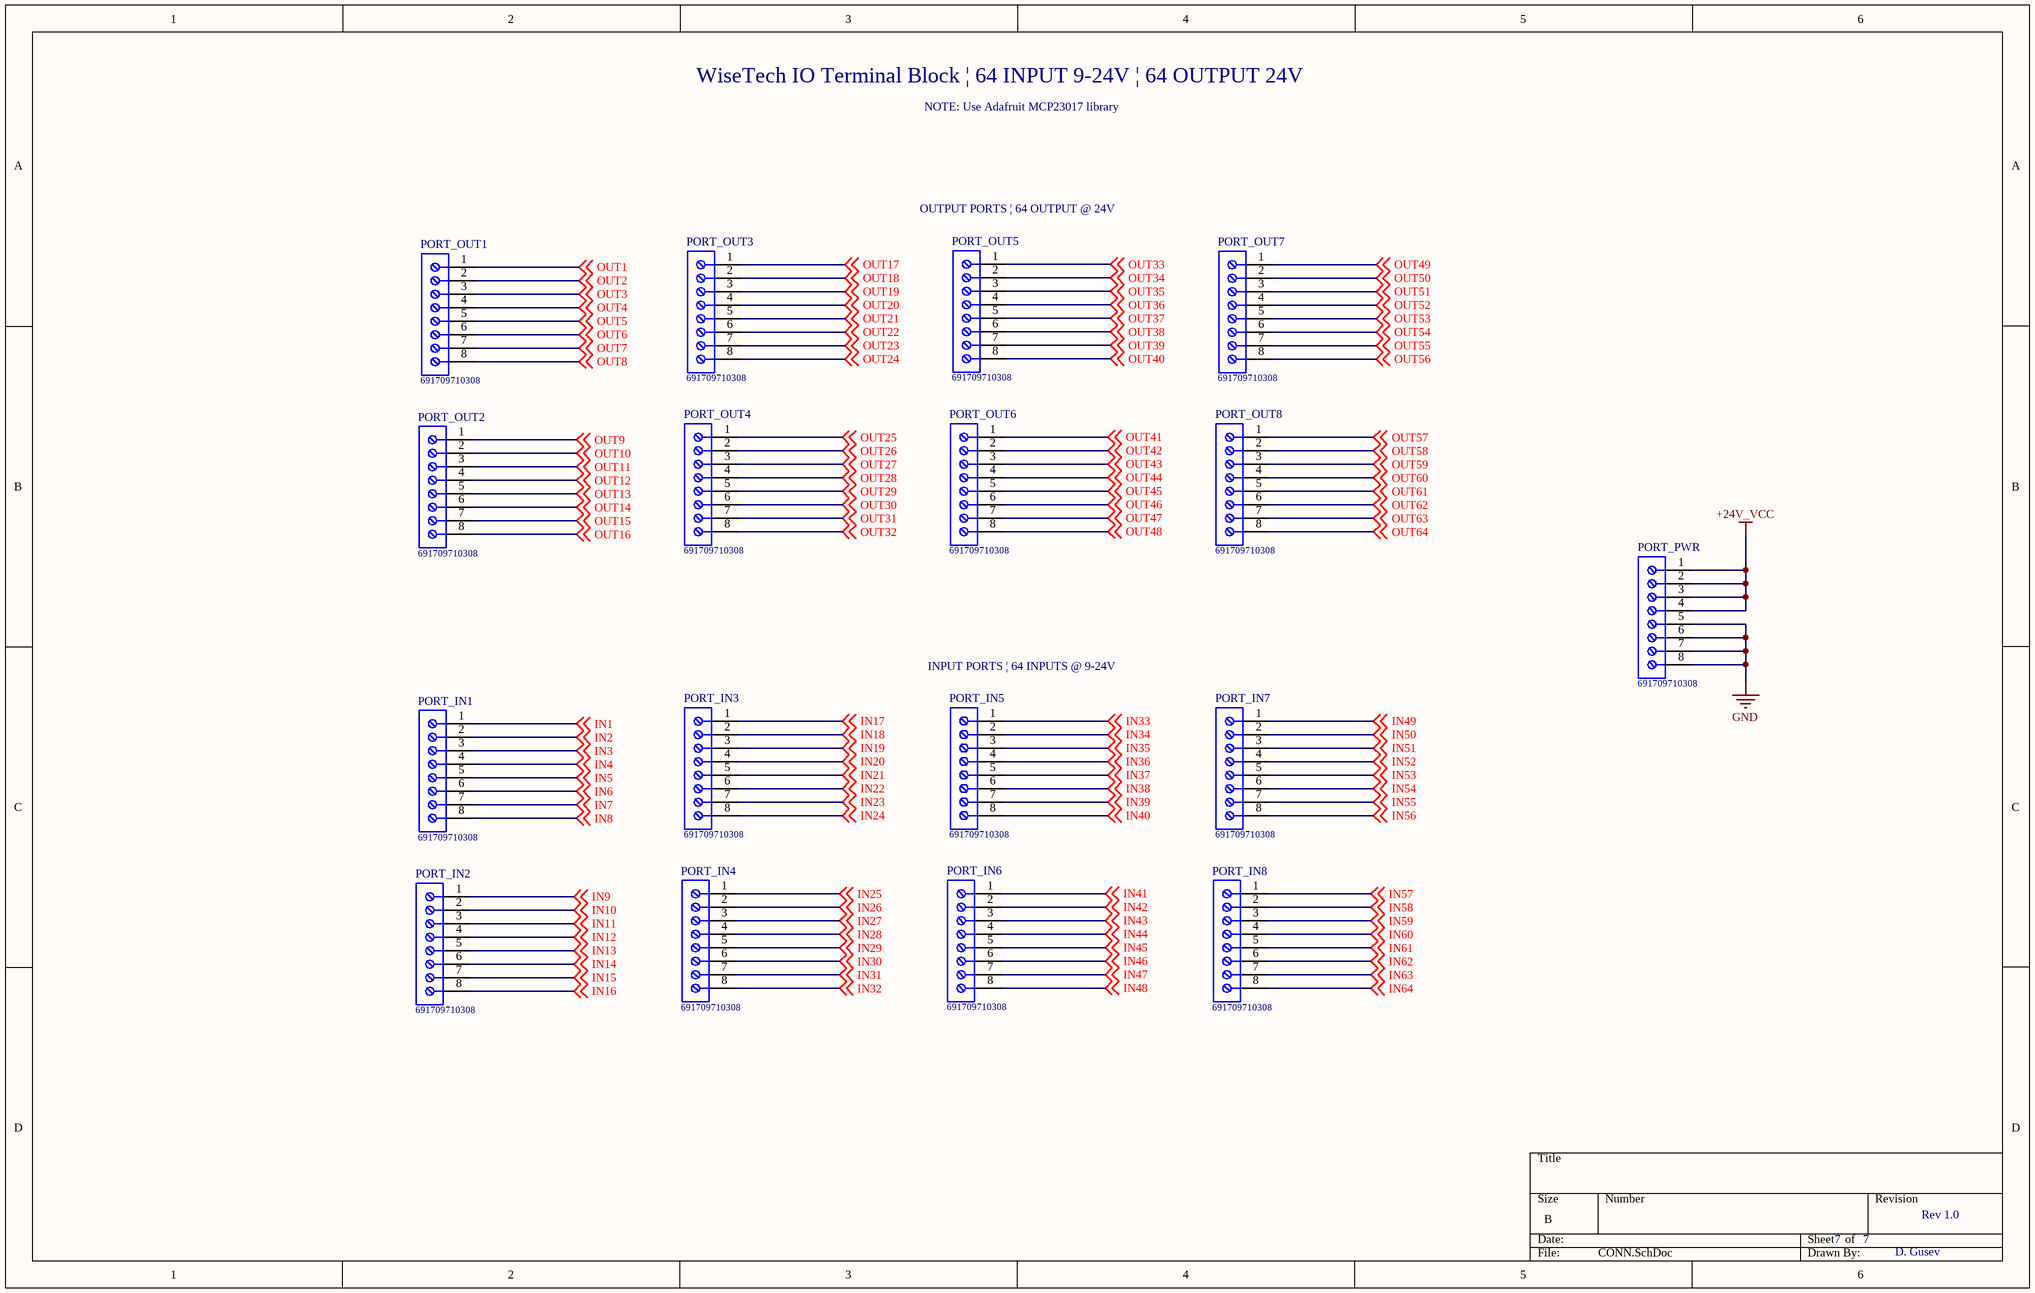
[diagram p14: CONN.SchDoc]

### Parts
PORT_IN1  691709710308  [691709710308]
PORT_IN2  691709710308  [691709710308]
PORT_IN3  691709710308  [691709710308]
PORT_IN4  691709710308  [691709710308]
PORT_IN5  691709710308  [691709710308]
PORT_IN6  691709710308  [691709710308]
PORT_IN7  691709710308  [691709710308]
PORT_IN8  691709710308  [691709710308]
PORT_OUT1  691709710308  [691709710308]
PORT_OUT2  691709710308  [691709710308]
PORT_OUT3  691709710308  [691709710308]
PORT_OUT4  691709710308  [691709710308]
PORT_OUT5  691709710308  [691709710308]
PORT_OUT6  691709710308  [691709710308]
PORT_OUT7  691709710308  [691709710308]
PORT_OUT8  691709710308  [691709710308]
PORT_PWR  691709710308  [691709710308]

### Nets
+24V_VCC: PORT_PWR.1 PORT_PWR.2 PORT_PWR.3 PORT_PWR.4
GND: PORT_PWR.5 PORT_PWR.6 PORT_PWR.7 PORT_PWR.8
IN1: PORT_IN1.1 ; off-sheet IN1
IN2: PORT_IN1.2 ; off-sheet IN2
IN3: PORT_IN1.3 ; off-sheet IN3
IN4: PORT_IN1.4 ; off-sheet IN4
IN5: PORT_IN1.5 ; off-sheet IN5
IN6: PORT_IN1.6 ; off-sheet IN6
IN7: PORT_IN1.7 ; off-sheet IN7
IN8: PORT_IN1.8 ; off-sheet IN8
IN9: PORT_IN2.1 ; off-sheet IN9
IN10: PORT_IN2.2 ; off-sheet IN10
IN11: PORT_IN2.3 ; off-sheet IN11
IN12: PORT_IN2.4 ; off-sheet IN12
IN13: PORT_IN2.5 ; off-sheet IN13
IN14: PORT_IN2.6 ; off-sheet IN14
IN15: PORT_IN2.7 ; off-sheet IN15
IN16: PORT_IN2.8 ; off-sheet IN16
IN17: PORT_IN3.1 ; off-sheet IN17
IN18: PORT_IN3.2 ; off-sheet IN18
IN19: PORT_IN3.3 ; off-sheet IN19
IN20: PORT_IN3.4 ; off-sheet IN20
IN21: PORT_IN3.5 ; off-sheet IN21
IN22: PORT_IN3.6 ; off-sheet IN22
IN23: PORT_IN3.7 ; off-sheet IN23
IN24: PORT_IN3.8 ; off-sheet IN24
IN25: PORT_IN4.1 ; off-sheet IN25
IN26: PORT_IN4.2 ; off-sheet IN26
IN27: PORT_IN4.3 ; off-sheet IN27
IN28: PORT_IN4.4 ; off-sheet IN28
IN29: PORT_IN4.5 ; off-sheet IN29
IN30: PORT_IN4.6 ; off-sheet IN30
IN31: PORT_IN4.7 ; off-sheet IN31
IN32: PORT_IN4.8 ; off-sheet IN32
IN33: PORT_IN5.1 ; off-sheet IN33
IN34: PORT_IN5.2 ; off-sheet IN34
IN35: PORT_IN5.3 ; off-sheet IN35
IN36: PORT_IN5.4 ; off-sheet IN36
IN37: PORT_IN5.5 ; off-sheet IN37
IN38: PORT_IN5.6 ; off-sheet IN38
IN39: PORT_IN5.7 ; off-sheet IN39
IN40: PORT_IN5.8 ; off-sheet IN40
IN41: PORT_IN6.1 ; off-sheet IN41
IN42: PORT_IN6.2 ; off-sheet IN42
IN43: PORT_IN6.3 ; off-sheet IN43
IN44: PORT_IN6.4 ; off-sheet IN44
IN45: PORT_IN6.5 ; off-sheet IN45
IN46: PORT_IN6.6 ; off-sheet IN46
IN47: PORT_IN6.7 ; off-sheet IN47
IN48: PORT_IN6.8 ; off-sheet IN48
IN49: PORT_IN7.1 ; off-sheet IN49
IN50: PORT_IN7.2 ; off-sheet IN50
IN51: PORT_IN7.3 ; off-sheet IN51
IN52: PORT_IN7.4 ; off-sheet IN52
IN53: PORT_IN7.5 ; off-sheet IN53
IN54: PORT_IN7.6 ; off-sheet IN54
IN55: PORT_IN7.7 ; off-sheet IN55
IN56: PORT_IN7.8 ; off-sheet IN56
IN57: PORT_IN8.1 ; off-sheet IN57
IN58: PORT_IN8.2 ; off-sheet IN58
IN59: PORT_IN8.3 ; off-sheet IN59
IN60: PORT_IN8.4 ; off-sheet IN60
IN61: PORT_IN8.5 ; off-sheet IN61
IN62: PORT_IN8.6 ; off-sheet IN62
IN63: PORT_IN8.7 ; off-sheet IN63
IN64: PORT_IN8.8 ; off-sheet IN64
OUT1: PORT_OUT1.1 ; off-sheet OUT1
OUT2: PORT_OUT1.2 ; off-sheet OUT2
OUT3: PORT_OUT1.3 ; off-sheet OUT3
OUT4: PORT_OUT1.4 ; off-sheet OUT4
OUT5: PORT_OUT1.5 ; off-sheet OUT5
OUT6: PORT_OUT1.6 ; off-sheet OUT6
OUT7: PORT_OUT1.7 ; off-sheet OUT7
OUT8: PORT_OUT1.8 ; off-sheet OUT8
OUT9: PORT_OUT2.1 ; off-sheet OUT9
OUT10: PORT_OUT2.2 ; off-sheet OUT10
OUT11: PORT_OUT2.3 ; off-sheet OUT11
OUT12: PORT_OUT2.4 ; off-sheet OUT12
OUT13: PORT_OUT2.5 ; off-sheet OUT13
OUT14: PORT_OUT2.6 ; off-sheet OUT14
OUT15: PORT_OUT2.7 ; off-sheet OUT15
OUT16: PORT_OUT2.8 ; off-sheet OUT16
OUT17: PORT_OUT3.1 ; off-sheet OUT17
OUT18: PORT_OUT3.2 ; off-sheet OUT18
OUT19: PORT_OUT3.3 ; off-sheet OUT19
OUT20: PORT_OUT3.4 ; off-sheet OUT20
OUT21: PORT_OUT3.5 ; off-sheet OUT21
OUT22: PORT_OUT3.6 ; off-sheet OUT22
OUT23: PORT_OUT3.7 ; off-sheet OUT23
OUT24: PORT_OUT3.8 ; off-sheet OUT24
OUT25: PORT_OUT4.1 ; off-sheet OUT25
OUT26: PORT_OUT4.2 ; off-sheet OUT26
OUT27: PORT_OUT4.3 ; off-sheet OUT27
OUT28: PORT_OUT4.4 ; off-sheet OUT28
OUT29: PORT_OUT4.5 ; off-sheet OUT29
OUT30: PORT_OUT4.6 ; off-sheet OUT30
OUT31: PORT_OUT4.7 ; off-sheet OUT31
OUT32: PORT_OUT4.8 ; off-sheet OUT32
OUT33: PORT_OUT5.1 ; off-sheet OUT33
OUT34: PORT_OUT5.2 ; off-sheet OUT34
OUT35: PORT_OUT5.3 ; off-sheet OUT35
OUT36: PORT_OUT5.4 ; off-sheet OUT36
OUT37: PORT_OUT5.5 ; off-sheet OUT37
OUT38: PORT_OUT5.6 ; off-sheet OUT38
OUT39: PORT_OUT5.7 ; off-sheet OUT39
OUT40: PORT_OUT5.8 ; off-sheet OUT40
OUT41: PORT_OUT6.1 ; off-sheet OUT41
OUT42: PORT_OUT6.2 ; off-sheet OUT42
OUT43: PORT_OUT6.3 ; off-sheet OUT43
OUT44: PORT_OUT6.4 ; off-sheet OUT44
OUT45: PORT_OUT6.5 ; off-sheet OUT45
OUT46: PORT_OUT6.6 ; off-sheet OUT46
OUT47: PORT_OUT6.7 ; off-sheet OUT47
OUT48: PORT_OUT6.8 ; off-sheet OUT48
OUT49: PORT_OUT7.1 ; off-sheet OUT49
OUT50: PORT_OUT7.2 ; off-sheet OUT50
OUT51: PORT_OUT7.3 ; off-sheet OUT51
OUT52: PORT_OUT7.4 ; off-sheet OUT52
OUT53: PORT_OUT7.5 ; off-sheet OUT53
OUT54: PORT_OUT7.6 ; off-sheet OUT54
OUT55: PORT_OUT7.7 ; off-sheet OUT55
OUT56: PORT_OUT7.8 ; off-sheet OUT56
OUT57: PORT_OUT8.1 ; off-sheet OUT57
OUT58: PORT_OUT8.2 ; off-sheet OUT58
OUT59: PORT_OUT8.3 ; off-sheet OUT59
OUT60: PORT_OUT8.4 ; off-sheet OUT60
OUT61: PORT_OUT8.5 ; off-sheet OUT61
OUT62: PORT_OUT8.6 ; off-sheet OUT62
OUT63: PORT_OUT8.7 ; off-sheet OUT63
OUT64: PORT_OUT8.8 ; off-sheet OUT64

### Notes on the sheet
- WiseTech IO Terminal Block | 64 INPUT 9-24V | 64 OUTPUT 24V
- NOTE: Use Adafruit MCP23017 library
- (near PORT_OUT5) OUTPUT PORTS | 64 OUTPUT @ 24V
- (near PORT_IN5) INPUT PORTS | 64 INPUTS @ 9-24V
- 7
- Rev 1.0
- D. Gusev

### Library data of the parts
PORT_IN1-PORT_IN8 PORT_OUT1-PORT_OUT8 PORT_PWR = CMP-1502-03340-1: Serie 7097 - 5.00 mm Horizontal Entry SMT with Pressure Clamp WR-TBL, 8 pin; Manufacturer: Wurth Elektronik; Pin Number: 8; Pitch: 5.00mm; Datasheet URL: http://katalog.we-online.de/em/datasheet/6917097103xx.pdf; Publisher: WurthElektronik; Part Number: 691709710308; Operating Temperature: -45to130degC; Mounting Technology: SMT; Package Reference: 691709710308; Packaging: TapeandReelwithCap; Manufacturer URL: http://www.we-online.de

## Nets that join several sheets
3V3: LAN9252-1 (6 pins), LAN9252-2 (J?#1.52 J?#1.53 J?#1.56 J?#1.57)
+3V3: USB-ESP32 (6 pins), ESP32 (C7.1 ESP32.2 R6#2.2 R7#2.2), LAN9252-1 (11 pins), EtherCAT (6 pins)
+5V: USB-ESP32 (8 pins), MCP23017-1 (26 pins)
+5VDD: VOLT_REGULATION (C41.2 L3.2 U3.4), USB-ESP32 (D1.2)
+24V_VCC: VOLT_REGULATION (C40.2 U3.1), MCP23017-1 (8 pins), CONN (PORT_PWR.1 PORT_PWR.2 PORT_PWR.3 PORT_PWR.4)
GND: VOLT_REGULATION (7 pins), USB-ESP32 (21 pins), ESP32 (7 pins), LAN9252-1 (30 pins), LAN9252-2 (7 pins), EtherCAT (26 pins), MCP23017-1 (49 pins), CONN (PORT_PWR.5 PORT_PWR.6 PORT_PWR.7 PORT_PWR.8)
VDD33TXRX1: LAN9252-1 (C?#1.2 C?#3.2 FB1.2 LAN9252.51), EtherCAT (5 pins)
VDD33TXRX2: LAN9252-1 (C?#5.2 C?#6.2 FB2.2 LAN9252.64), EtherCAT (5 pins)
ESP32-I2C-SCL: ESP32 (ESP32.36), MCP23017-1 (U4.12)
ESP32-I2C-SDA: ESP32 (ESP32.33), MCP23017-1 (U4.13)
ESP32_RX: USB-ESP32 (U1.20), ESP32 (ESP32.34)
ESP32_TX: USB-ESP32 (U1.4), ESP32 (ESP32.35)
GPIO0: USB-ESP32 (Q2.3), ESP32 (ESP32.25 ESP32_BOOT.2 R7#2.1)
GPIO0: LAN9252-1 (LAN9252.48), EtherCAT (R?#11.2 R?#13.2)
GPIO1: LAN9252-1 (LAN9252.46), EtherCAT (R?#14.2 R?#22.2)
IN1: MCP23017-1 (R25.1), CONN (PORT_IN1.1)
IN2: MCP23017-1 (R28.1), CONN (PORT_IN1.2)
IN3: MCP23017-1 (R31#2.1), CONN (PORT_IN1.3)
IN4: MCP23017-1 (R34.1), CONN (PORT_IN1.4)
IN5: MCP23017-1 (R37.1), CONN (PORT_IN1.5)
IN6: MCP23017-1 (R40.1), CONN (PORT_IN1.6)
IN7: MCP23017-1 (R43.1), CONN (PORT_IN1.7)
IN8: MCP23017-1 (R46.1), CONN (PORT_IN1.8)
IRQ: LAN9252-1 (LAN9252.44), LAN9252-2 (J?#1.49)
NetC?#23_2: LAN9252-1 (LAN9252.53), EtherCAT (C?#23.2 EtherCAT_INPUT.1 R?#5.1)
NetC?#24_2: LAN9252-1 (LAN9252.52), EtherCAT (C?#24.2 EtherCAT_INPUT.3 R?#6.1)
NetC?#25_2: LAN9252-1 (LAN9252.55), EtherCAT (C?#25.2 EtherCAT_INPUT.5 R?#7.1)
NetC?#26_2: LAN9252-1 (LAN9252.54), EtherCAT (C?#26.2 EtherCAT_INPUT.7 R?#8.1)
NetC?#29_2: LAN9252-1 (LAN9252.62), EtherCAT (C?#29.2 EtherCAT_OUTPUT.1 R?#15.1)
NetC?#30_2: LAN9252-1 (LAN9252.63), EtherCAT (C?#30.2 EtherCAT_OUTPUT.3 R?#16.1)
NetC?#31_2: LAN9252-1 (LAN9252.60), EtherCAT (C?#31.2 EtherCAT_OUTPUT.5 R?#17.1)
NetC?#32_2: LAN9252-1 (LAN9252.61), EtherCAT (C?#32.2 EtherCAT_OUTPUT.7 R?#18.1)
NetEtherCAT_EEPROM_5: LAN9252-1 (LAN9252.42), EtherCAT (EtherCAT_EEPROM.5 R?#21.1)
NetEtherCAT_EEPROM_6: LAN9252-1 (LAN9252.43), EtherCAT (EtherCAT_EEPROM.6 R?#20.1)
NetLAN9252_45: LAN9252-1 (LAN9252.45), EtherCAT (R?#10.2 R?#12.1)
OUT1: MCP23017-1 (Q3.3), CONN (PORT_OUT1.1)
OUT2: MCP23017-1 (Q4.3), CONN (PORT_OUT1.2)
OUT3: MCP23017-1 (Q5.3), CONN (PORT_OUT1.3)
OUT4: MCP23017-1 (Q6.3), CONN (PORT_OUT1.4)
OUT5: MCP23017-1 (Q7.3), CONN (PORT_OUT1.5)
OUT6: MCP23017-1 (Q8.3), CONN (PORT_OUT1.6)
OUT7: MCP23017-1 (Q9.3), CONN (PORT_OUT1.7)
OUT8: MCP23017-1 (Q10.3), CONN (PORT_OUT1.8)
RESET: USB-ESP32 (Q1.3), ESP32 (ESP32.3 ESP32_RESET.2 R6#2.1)